# EAGLE design Shifting_microSD (EAGLE 7.4.0)
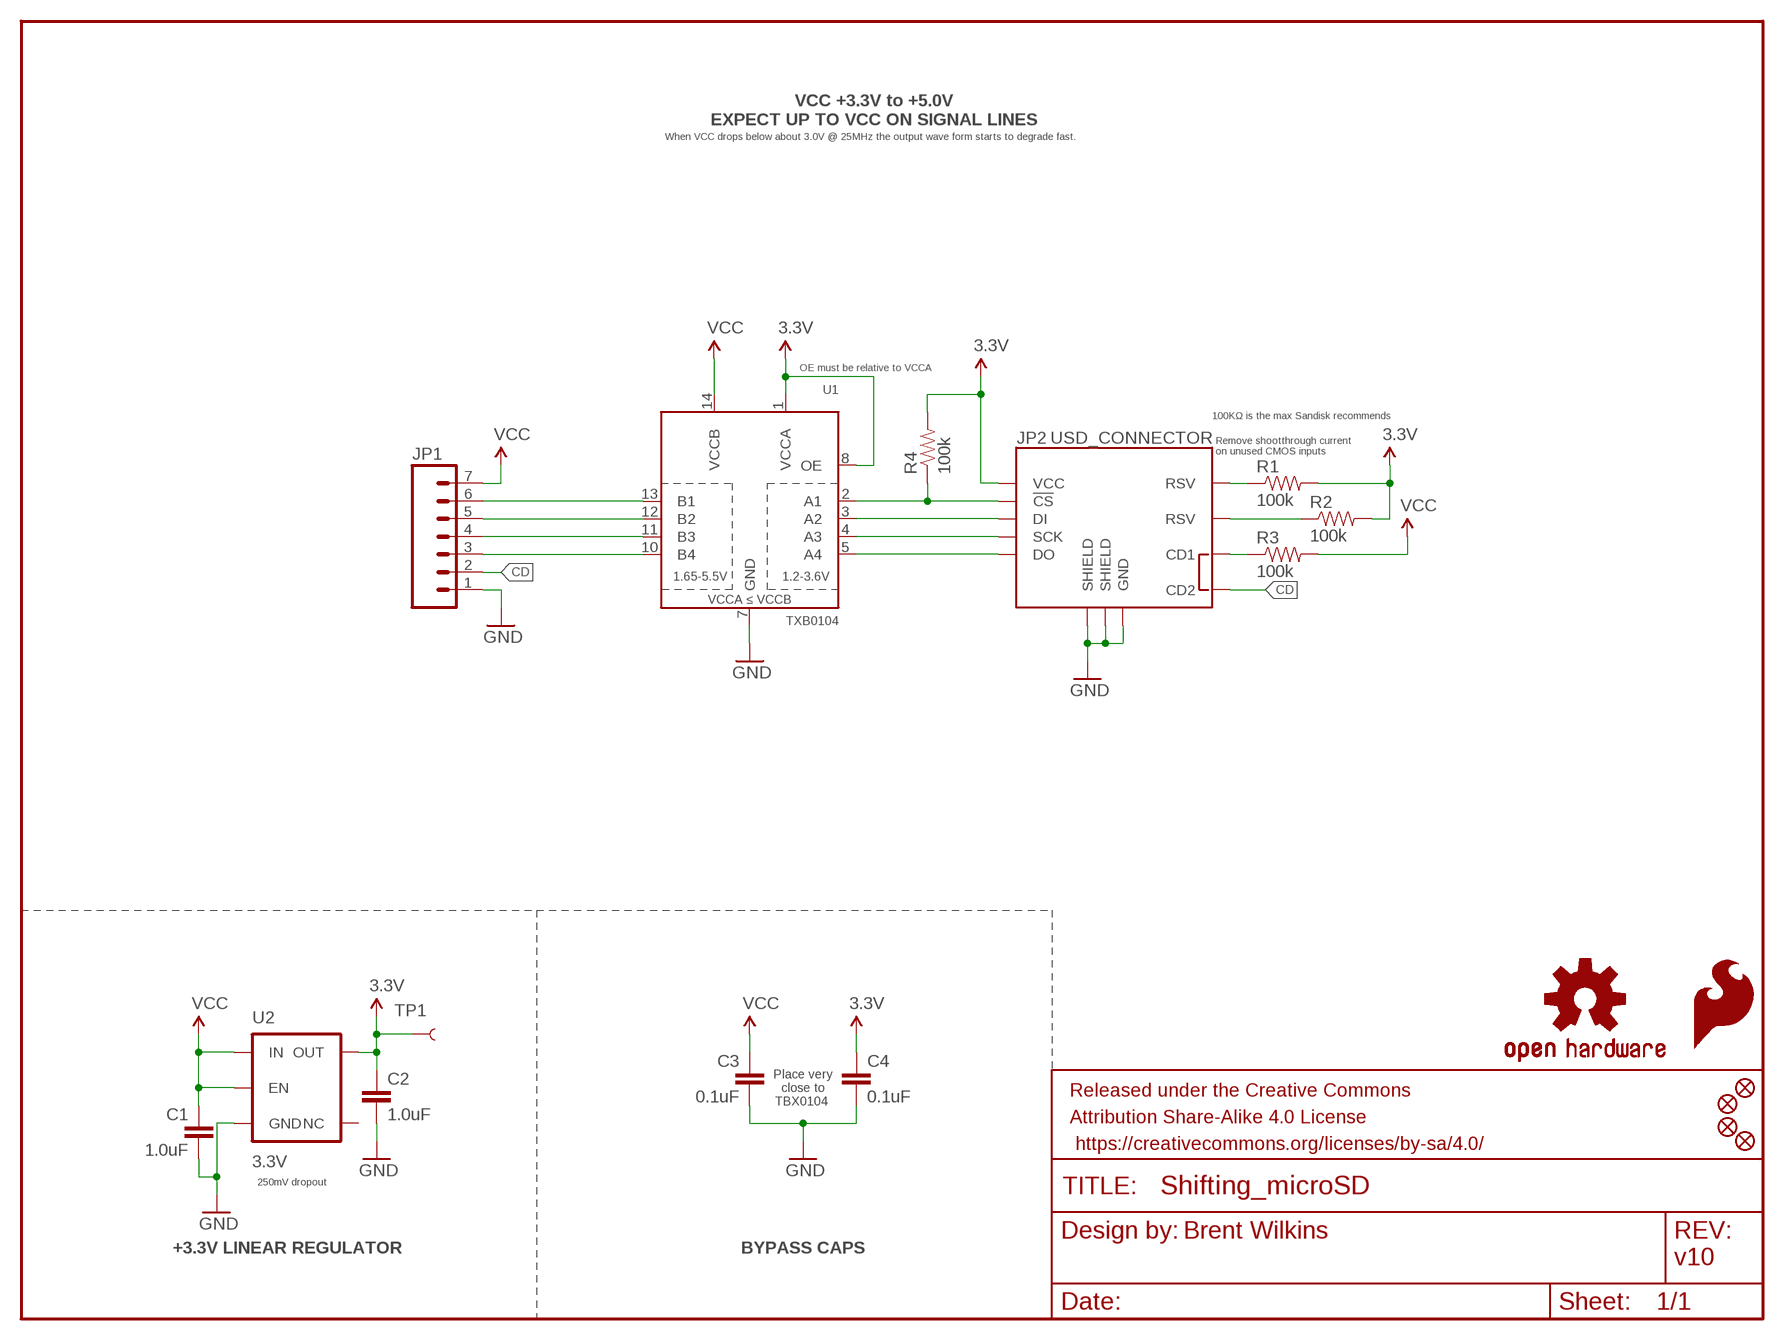
[diagram p0: schematic, sheet 1]

## Parts
C1  1.0uF  1.0UF-16V-10%(0603)  [0603-CAP]
C2  1.0uF  1.0UF-16V-10%(0603)  [0603-CAP]
C3  0.1uF  0.1UF-25V(+80/-20%)(0603)  [0603-CAP]
C4  0.1uF  0.1UF-25V(+80/-20%)(0603)  [0603-CAP]
FID1  FIDUCIAL1X2  [FIDUCIAL-1X2]
FID2  FIDUCIAL1X2  [FIDUCIAL-1X2]
FID3  FIDUCIAL1X2  [FIDUCIAL-1X2]
FID4  FIDUCIAL1X2  [FIDUCIAL-1X2]
FRAME1  FRAME-LETTER  [CREATIVE_COMMONS]
JP1  M07  [1X07]
JP2  USD_CONNECTOR  [MICRO-SD-SOCKET-PP]
LOGO1  SFE_LOGO_FLAME.2_INCH  [SFE_LOGO_FLAME_.2]
LOGO2  OSHW-LOGOS  [OSHW-LOGO-S]
R1  100k  100KOHM-1/10W-1%(0603)  [0603-RES]
R2  100k  100KOHM-1/10W-1%(0603)  [0603-RES]
R3  100k  100KOHM-1/10W-1%(0603)  [0603-RES]
R4  100k  100KOHM-1/10W-1%(0603)  [0603-RES]
TP1  TEST-POINT3  [PAD.03X.03]
U1  TXB0104  TXB0104PWRSOIC14  [SO14]
U2  3.3V  V_REG_AP2112K-3.3V  [SOT23-5]

## Nets
3V3: C2.1 C4.1 JP2.VCC R1.2 R2.2 R4.2 TP1.P$1 U1.1(VCCA) U1.8(OE) U2.5(OUT) ; supply symbol labelled 3.3V
!CS_3V3: JP2.CS(!CS) R4.1 U1.2(A1)
CD: JP1.2 JP2.CD2
CDSDSD: JP2.CD1 R3.1
DI: JP1.5 U1.12(B2)
DI_3V3: JP2.DI U1.3(A2)
DO: JP1.3 U1.10(B4)
DO_3V3: JP2.DO U1.5(A4)
GND: C1.2 C2.2 C3.2 C4.2 JP1.1 JP2.GND JP2.GND1(SHIELD) JP2.GND3(SHIELD) U1.7(GND) U2.2(GND)
N$1: JP1.6 U1.13(B1)
N$3: JP1.4 U1.11(B3)
RSV@1: JP2.RSV1(RSV) R1.1
RSV@2: JP2.RSV2(RSV) R2.1
SCK_3V3: JP2.SCLK(SCK) U1.4(A3)
VDD_IO: C1.1 C3.1 JP1.7 R3.2 U1.14(VCCB) U2.1(IN) U2.3(EN) ; supply symbol labelled VCC
Unconnected: U2.4(NC)

## Notes on the sheet
- VCC +3.3V to +5.0V
  EXPECT UP TO VCC ON SIGNAL LINES
- When VCC drops below about 3.0V @ 25MHz the output wave form starts to degrade fast.
- OE must be relative to VCCA
- 100KΩ is the max Sandisk recommends
- Remove shootthrough current
  on unused CMOS inputs
- Place very
  close to
  TBX0104
- 250mV dropout
- Brent Wilkins
- +3.3V LINEAR REGULATOR | BYPASS CAPS
- v10

## Library data of the parts
C1 C2 = SparkFun-Capacitors:1.0UF-16V-10%(0603): CAP-00868; PROD_ID: CAP-00868
C3 C4 = SparkFun-Capacitors:0.1UF-25V(+80/-20%)(0603): CAP-00810 Ceramic Standard decoupling cap; PROD_ID: CAP-00810
FID1-FID4 = SparkFun-Aesthetics:FIDUCIAL: Fiducial Alignment Points Various fiducial points for machine vision alignment.
FRAME1 = SparkFun-Aesthetics:FRAME-LETTER: Schematic Frame Standard 8.5x11 US Letter frame
JP1 = SparkFun-Connectors:M07: Header 7 Standard 7-pin 0.1" header. Use with straight break away headers (SKU : PRT-00116), right angle break away headers (PRT-00553), swiss pins (PRT-00743), machine pins (PRT-00117), and female headers (PRT-00115). NOTES ON THE VARIANTS LOCK and LOCK_LONGPADS... This footprint was designed to help hold the alignment of a through-hole component (i.e. 7-pin header) while soldering it into place. You may notice that each hole has been shifted either up or down by 0.005 of an inch from it's more standard position (which is usually a perfectly straight line). This slight alteration caused the pins (the squares in the middle) to touch the edges of the holes. Because they are alternating, it causes a "brace" to hold the header in place. 0.005 has proven to be the perfect amount of "off-center" position when using our standard breakaway headers. Although looks a little odd when you look at the bare footprint, once you have a header in there, the alteration is very hard to notice. Also, if you push a header all the way into place, it is covered up entirely on the bottom side. This idea of altering the position of holes to aid alignment will be further integrated into the Sparkfun Library for other footprints. It can help hold any component with 3 or more connection pins.
JP2 = SparkFun-Connectors:USD_CONNECTOR: microSD Socket Push-push type µSD socket. Footprint production proven. Symbol has new and improved layout and naming accuracy. SparkFun Electronics SKU : PRT-00127. tDoc lines correctly indicate media card edge positions when inserting (unlocked, locked, depressed). NOTE: CD1 and CD2 are connected internally; PROD_ID: CONN-07820
LOGO1 = SparkFun-Aesthetics:SFE_LOGO_FLAME: SFE Logo, flame only This is the SparkFun flame logo. The logo on the schematic will always be the same size; the package variant is the height of the flame. Default layer for the logo on the board is tSilk.
LOGO2 = SparkFun-Aesthetics:OSHW-LOGO: Open Source Hardware Logo This logo indicates the piece of hardware it is found on incorporates a OSHW license and/or adheres to the definition of open source hardware found here: http://freedomdefined.org/OSHW
R1-R4 = SparkFun-Resistors:100KOHM-1/10W-1%(0603): RES-07828; PROD_ID: RES-07828
TP1 = SparkFun-Passives:TEST-POINT: Bare copper test points for troubleshooting or ICT
U1 = SparkFun-DigitalIC:TXB0104PWR: 4-Bit Bi-Directional Level Shifter 1.2V-3.6V (VCCA) to 1.65V-5.5V (VCCB) bi-directional level shifter with auto direction sensing. Max data rate - VCCA 1.8V: 20Mbps (50ns), VCCA 3.3V: 100Mbps (10ns) Digikey: 296-21929-1-ND (TSSOP) IC-11329; PROD_ID: IC-11329
U2 = SparkFun-PowerIC:V_REG_AP2112: AP2112 - 600mA CMOS LDO Regulator w/ Enable The AP2112 is CMOS process low dropout linear regulator with enable function, the regulator delivers a guaranteed 600mA (min.) continuous load current. Features Output Voltage Accuracy: ±1.5% Output Current: 600mA (Min.) Foldback Short Current Protection: 50mA Enable Function to Turn ON/OFF VOUT Low Dropout Voltage (3.3V): 250mV (Typ.) @IOUT=600mA Excellent Load Regulation: 0.2%/A (Typ.) Excellent Line Regulation: 0.02%/V (Typ.) Low Quiescent Current: 55μA (Typ.) Low Standby Current: 0.01μA (Typ.) Low Output Noise: 50μVRMS PSRR: 100Hz -65dB, 1kHz -65dB OTSD Protection Stable with 1.0μF Flexible Cap: Ceramic, Tantalum and Aluminum Electrolytic Operation Temperature Range: -40°C to 85°C ESD: MM 400V, HBM 4000V; PROD_ID: VREG-12457

## Board
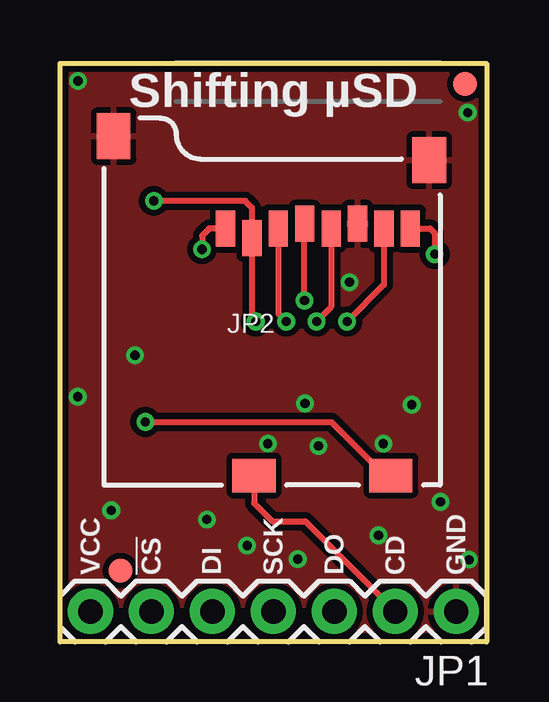
[diagram p1: board, top side]
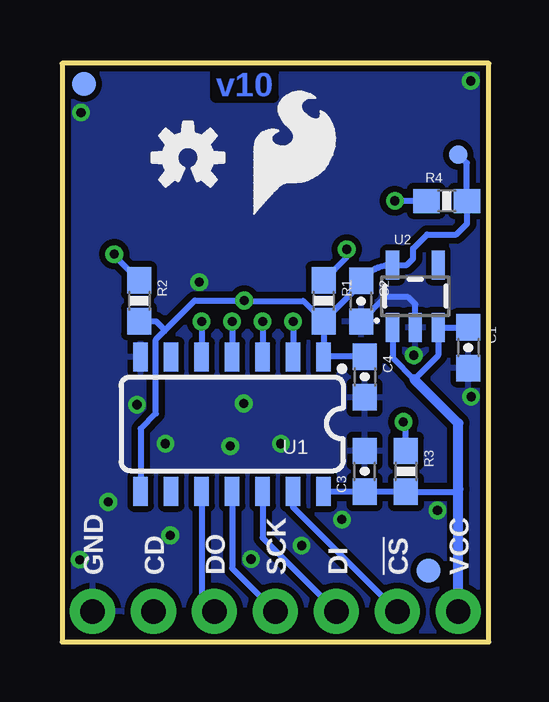
[diagram p2: board, bottom side, seen from below]

Size 17.78 x 24.13 mm. Coordinates in mm from the lower left corner, seen from the top.
Outline: 0,24.13 17.78,24.13 17.78,0 0,0 0,24.13
Copper layers (1*16): Top 0.035mm / dielectric 1.5mm / Bottom 0.035mm
Design rules "SparkFun-2-layer-TIGHT": minimum track width 7mil, minimum drill 15mil, track to track 7mil, track to pad 7mil, pad to pad 7mil, via to via 7mil, smd to smd 7mil, copper to edge 7mil, drill to drill 7mil, minimum pad ring 7mil, minimum via ring 7mil, stop-mask expansion 4mil, vias tented up to drill 20mil, thermal gap 10mil

### Footprints (pad centres in the part's own frame; a part is rotated, then mirrored left to right if it is on the bottom)
0603-CAP = smd 1.1 x 1: 1 -0.85,0; 2 0.85,0
FIDUCIAL-1X2 = smd 1 x 1: 1 0,0
1X07 = drill 1.016 pad 1.88: 1 0,0; 2 2.54,0; 3 5.08,0; 4 7.62,0; 5 10.16,0; 6 12.7,0; 7 15.24,0
MICRO-SD-SOCKET-PP = smd 1.8 x 1.4: CD1 -2.05,0.4; CD2 -7.75,0.4 | smd 0.8 x 1.5: CS -7.84,10.3; DI -6.74,10.7; DO -2.34,10.7; GND -3.44,10.9; RSV1 -8.94,10.7; RSV2 -1.24,10.7; SCLK -4.54,10.7; VCC -5.64,10.9 | smd 1.4 x 1.9: GND1 -13.6,14.55; GND3 -0.45,13.55
0603-RES = smd 1.1 x 1: 1 -0.85,0; 2 0.85,0
PAD.03X.03 = smd 0.762 x 0.762: P$1 0,0
SO14 = smd 0.6 x 1.2: 1 -3.81,-2.8; 2 -2.54,-2.8; 3 -1.27,-2.8; 4 0,-2.8; 5 1.27,-2.8; 6 2.54,-2.8; 7 3.81,-2.8; 8 3.81,2.8; 9 2.54,2.8; 10 1.27,2.8; 11 0,2.8; 12 -1.27,2.8; 13 -2.54,2.8; 14 -3.81,2.8
SOT23-5 = smd 0.55 x 1.2: 1 -0.95,-1.3; 2 0,-1.3; 3 0.95,-1.3; 4 0.95,1.3; 5 -0.95,1.3

### Placement (x,y rotation side)
C1  0.85,12.27 270 bottom
C2  5.32,14.21 270 bottom
C3  5.17,7.11 90 bottom
C4  5.17,11.05 270 bottom
FID1  16.87,23.27 0 bottom
FID2  2.51,2.97 0 bottom
FID3  16.87,23.27 0 top
FID4  2.51,2.97 0 top
FRAME1  -23.37,-9.78 0 top  (outside the outline)
JP1  16.51,1.27 180 top
JP2  15.84,6.54 0 top
LOGO1  10.12,17.59 0 bottom
LOGO2  12.53,20.19 0 bottom
R1  6.88,14.22 270 bottom
R2  14.57,14.22 270 bottom
R3  3.45,7.11 270 bottom
R4  1.75,18.39 0 bottom
TP1  1.27,20.32 0 bottom
U1  10.69,9.08 180 bottom
U2  3.06,14.41 0 bottom

### Tracks (layer width: path | path; a pad name or v marks a point on that pad's centre or on a via)
3V3  (via drill 0.38)
  Top 0.254: v10.19,14.24 10.19,17.43 JP2.VCC
  Bottom 0.254: 13.52,12.96 12.24,14.24 v10.19,14.24 10.17,14.22 7.73,14.22 R1.2 | 13.52,12.96 13.87,12.61 13.87,9.53 14.5,8.89 U1.8 | R1.2 U1.1 6.87,11.9 C4.1 | R2.2 13.87,13.37 13.52,13.03 13.52,12.96 | R1.2 5.32,14.94 C2.1 arc53 U2.5 3.41,15.71 3.15,15.98 3.15,16.41 2.56,16.99 1.35,16.99 0.9,17.44 R4.2 0.91,18.39 0.91,19.96 TP1.P$1
!CS_3V3  (via drill 0.38)
  Top 0.254: v8.15,13.36 8,13.36 JP2.CS 8,18.11 7.72,18.39 v3.91,18.39
  Bottom 0.254: v8.15,13.36 U1.2 | R4.1 v3.91,18.39
CD
  Top 0.254: JP2.CD2 8.09,5.78 8.84,5.03 10.21,5.03 JP1.2
CDSDSD  (via drill 0.38)
  Top 0.254: v3.56,9.17 11.3,9.17 13.13,7.34 13.39,7.34 JP2.CD1
  Bottom 0.254: R3.1 3.45,9.07 v3.56,9.17
DI
  Bottom 0.254: U1.12 9.42,4.34 JP1.5
DI_3V3  (via drill 0.38)
  Top 0.254: JP2.DI 9.1,13.69 v9.42,13.36
  Bottom 0.254: v9.42,13.36 U1.3
DO
  Bottom 0.254: U1.10 11.96,1.8 JP1.3
DO_3V3  (via drill 0.38)
  Top 0.254: JP2.DO 13.5,14.89 v11.96,13.36
  Bottom 0.254: v11.96,13.36 U1.5
GND  (via drill 0.38)
  Bottom 0.254: U2.2 3.06,14.08 3.35,14.38 4.31,14.38 C2.2
  other vias: 17.04,3.43 7.8,4.01 0.75,23.39 16.99,22.07 10.77,8.17 10.21,9.94 13.27,4.45 15.85,5.84 13.47,8.27 8.66,8.27 6.12,5.11 2.13,5.49 9.91,3.45 0.74,10.22 3.12,11.95 12.06,15 14.66,9.89
  pour Bottom (isolate 0.254, rank 2): 0,24.13 17.78,24.13 17.78,0 0,0
  pour Top (isolate 0.254): 0,24.13 17.78,24.13 17.78,0 0,0
N$1
  Bottom 0.254: U1.13 8.15,5.61 JP1.6
N$3
  Bottom 0.254: U1.11 10.69,3.07 JP1.4
RSV@1  (via drill 0.38)
  Top 0.254: JP2.RSV1 6.22,17.24 5.92,16.94 v5.92,16.37
  Bottom 0.254: R1.1 5.92,16.04 v5.92,16.37
RSV@2  (via drill 0.38)
  Top 0.254: JP2.RSV2 15.42,17.24 15.61,17.06 v15.61,16.17
  Bottom 0.254: R2.1 15.61,16.11 v15.61,16.17
SCK_3V3  (via drill 0.38)
  Top 0.254: JP2.SCLK 11.3,13.96 v10.69,13.36
  Bottom 0.254: v10.69,13.36 U1.4
VDD_IO
  Bottom 0.254: U2.1 4.01,11.86 3.1,10.95 2.11,11.94 U2.3 C1.1 | 1.27,6.38 1.38,6.26 R3.2 C3.1 6.87,6.26 U1.14
  Bottom 0.406: JP1.7 1.27,6.38 1.27,9.12 3.1,10.95

### Text on the board
tPlace: Shifting µSD | VCC | !CS | DI | SCK | DO | CD | GND
bPlace: VCC | !CS | DI | SCK | DO | CD | GND
Measures: All Units in Inches
tDocu: Brent Wilkins